# Altium schematic sheet XP2.SchDoc: XP2 Connections
size A; Organization: UCLA High Energy Physics; Address1: L3, 12a Rodborough Rd; Address2: Frenchs Forest; Address3: NSW; Address4: Australia 2086; DocumentNumber: 4; Revision: 2.0; SheetNumber: 4; SheetTotal: 23; CurrentDate: 9/6/2018; ModifiedDate: 9/6/2018; ProjectName: Project
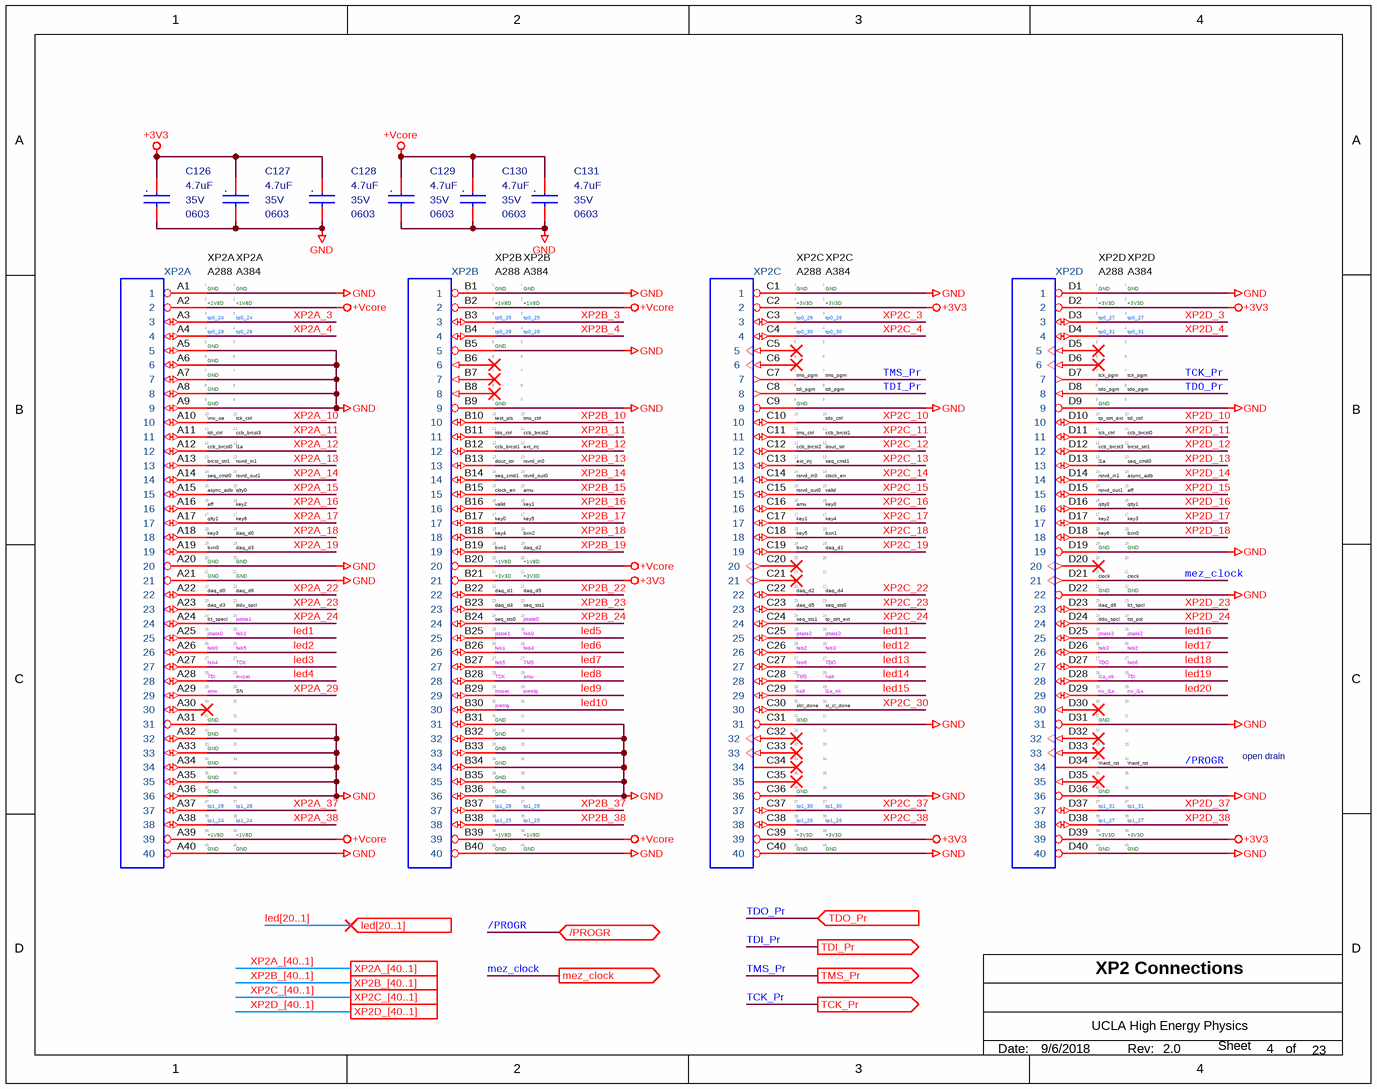
[diagram p0: XP2.SchDoc]

## Parts
(Parts that share a designator on the sheet are numbered #1, #2 ... from top to bottom, then left to right.)
C126  4.7uF  Voltage - Rated: 35V  package: 0603  [MC_S6/SM/C_0603_IPC]
C127  4.7uF  Voltage - Rated: 35V  package: 0603  [MC_S6/SM/C_0603_IPC]
C128  4.7uF  Voltage - Rated: 35V  package: 0603  [MC_S6/SM/C_0603_IPC]
C129  4.7uF  Voltage - Rated: 35V  package: 0603  [MC_S6/SM/C_0603_IPC]
C130  4.7uF  Voltage - Rated: 35V  package: 0603  [MC_S6/SM/C_0603_IPC]
C131  4.7uF  Voltage - Rated: 35V  package: 0603  [MC_S6/SM/C_0603_IPC]
XP2  Samtec_XP2  [MC_S6/TH/SAMTEC_MOLC_40x4]  (value not drawn)  (parts A,B,C,D of 4)
XP?#1  A288_XP2  (value not drawn)  (part A of 4)  (graphical)
XP?#2  A384_XP2  (value not drawn)  (part A of 4)  (graphical)
XP?#3  A288_XP2  (value not drawn)  (part B of 4)  (graphical)
XP?#4  A384_XP2  (value not drawn)  (part B of 4)  (graphical)
XP?#5  A288_XP2  (value not drawn)  (part C of 4)  (graphical)
XP?#6  A384_XP2  (value not drawn)  (part C of 4)  (graphical)
XP?#7  A288_XP2  (value not drawn)  (part D of 4)  (graphical)
XP?#8  A384_XP2  (value not drawn)  (part D of 4)  (graphical)

## Ports
/PROGR (bidir), led[20..1] (in), mez_clock (out), TCK_Pr (out), TDI_Pr (out), TDO_Pr (in), TMS_Pr (out), XP2A_[40..1], XP2B_[40..1], XP2C_[40..1], XP2D_[40..1]

## Nets
+3V3: C126.1 C127.1 C128.1 XP2.B21(21) XP2.C2(2) XP2.C39(39) XP2.D2(2) XP2.D39(39)
+Vcore: C129.1 C130.1 C131.1 XP2.A2(2) XP2.A39(39) XP2.B2(2) XP2.B20(20) XP2.B39(39)
GND: C126.2 C127.2 C128.2 C129.2 C130.2 C131.2 XP2.A1(1) XP2.A5(5) XP2.A6(6) XP2.A7(7) XP2.A8(8) XP2.A9(9) XP2.A20(20) XP2.A21(21) XP2.A31(31) XP2.A32(32) XP2.A33(33) XP2.A34(34) XP2.A35(35) XP2.A36(36) XP2.A40(40) XP2.B1(1) XP2.B5(5) XP2.B9(9) XP2.B31(31) XP2.B32(32) XP2.B33(33) XP2.B34(34) XP2.B35(35) XP2.B36(36) XP2.B40(40) XP2.C1(1) XP2.C9(9) XP2.C31(31) XP2.C36(36) XP2.C40(40) XP2.D1(1) XP2.D9(9) XP2.D19(19) XP2.D22(22) XP2.D31(31) XP2.D36(36) XP2.D40(40)
/PROGR: XP2.D34(34) ; port /PROGR
led1: XP2.A25(25)
led2: XP2.A26(26)
led3: XP2.A27(27)
led4: XP2.A28(28)
led5: XP2.B25(25)
led6: XP2.B26(26)
led7: XP2.B27(27)
led8: XP2.B28(28)
led9: XP2.B29(29)
led10: XP2.B30(30)
led11: XP2.C25(25)
led12: XP2.C26(26)
led13: XP2.C27(27)
led14: XP2.C28(28)
led15: XP2.C29(29)
led16: XP2.D25(25)
led17: XP2.D26(26)
led18: XP2.D27(27)
led19: XP2.D28(28)
led20: XP2.D29(29)
mez_clock: XP2.D21(21) ; port mez_clock
TCK_Pr: XP2.D7(7) ; port TCK_Pr
TDI_Pr: XP2.C8(8) ; port TDI_Pr
TDO_Pr: XP2.D8(8) ; port TDO_Pr
TMS_Pr: XP2.C7(7) ; port TMS_Pr
XP2A_3: XP2.A3(3)
XP2A_4: XP2.A4(4)
XP2A_10: XP2.A10(10)
XP2A_11: XP2.A11(11)
XP2A_12: XP2.A12(12)
XP2A_13: XP2.A13(13)
XP2A_14: XP2.A14(14)
XP2A_15: XP2.A15(15)
XP2A_16: XP2.A16(16)
XP2A_17: XP2.A17(17)
XP2A_18: XP2.A18(18)
XP2A_19: XP2.A19(19)
XP2A_22: XP2.A22(22)
XP2A_23: XP2.A23(23)
XP2A_24: XP2.A24(24)
XP2A_29: XP2.A29(29)
XP2A_37: XP2.A37(37)
XP2A_38: XP2.A38(38)
XP2B_3: XP2.B3(3)
XP2B_4: XP2.B4(4)
XP2B_10: XP2.B10(10)
XP2B_11: XP2.B11(11)
XP2B_12: XP2.B12(12)
XP2B_13: XP2.B13(13)
XP2B_14: XP2.B14(14)
XP2B_15: XP2.B15(15)
XP2B_16: XP2.B16(16)
XP2B_17: XP2.B17(17)
XP2B_18: XP2.B18(18)
XP2B_19: XP2.B19(19)
XP2B_22: XP2.B22(22)
XP2B_23: XP2.B23(23)
XP2B_24: XP2.B24(24)
XP2B_37: XP2.B37(37)
XP2B_38: XP2.B38(38)
XP2C_3: XP2.C3(3)
XP2C_4: XP2.C4(4)
XP2C_10: XP2.C10(10)
XP2C_11: XP2.C11(11)
XP2C_12: XP2.C12(12)
XP2C_13: XP2.C13(13)
XP2C_14: XP2.C14(14)
XP2C_15: XP2.C15(15)
XP2C_16: XP2.C16(16)
XP2C_17: XP2.C17(17)
XP2C_18: XP2.C18(18)
XP2C_19: XP2.C19(19)
XP2C_22: XP2.C22(22)
XP2C_23: XP2.C23(23)
XP2C_24: XP2.C24(24)
XP2C_30: XP2.C30(30)
XP2C_37: XP2.C37(37)
XP2C_38: XP2.C38(38)
XP2D_3: XP2.D3(3)
XP2D_4: XP2.D4(4)
XP2D_10: XP2.D10(10)
XP2D_11: XP2.D11(11)
XP2D_12: XP2.D12(12)
XP2D_13: XP2.D13(13)
XP2D_14: XP2.D14(14)
XP2D_15: XP2.D15(15)
XP2D_16: XP2.D16(16)
XP2D_17: XP2.D17(17)
XP2D_18: XP2.D18(18)
XP2D_23: XP2.D23(23)
XP2D_24: XP2.D24(24)
XP2D_37: XP2.D37(37)
XP2D_38: XP2.D38(38)

Not connected (* = marked no-connect by the designer): XP2 A30(30)* B6(6)* B7(7)* B8(8)* C5(5)* C6(6)* C20(20)* C21(21)* C32(32)* C33(33)* C34(34)* C35(35)* D5(5)* D6(6)* D20(20)* D30(30)* D32(32)* D33(33)* D35(35)*

## Buses and harness runs
bus led[20..1] = port led[20..1]
bus XP2A_[40..1] = port XP2A_[40..1]
bus XP2B_[40..1] = port XP2B_[40..1]
bus XP2C_[40..1] = port XP2C_[40..1]
bus XP2D_[40..1] = port XP2D_[40..1]

## Notes on the sheet
- open drain
- Date:
- Rev:
- of
- Sheet
- (in symbol A288_XP2, part A) XP2A; A288; 1; GND; 2; +1V8D; 3; tp0_24; 4; tp0_28; 5; 6; 7; 8; 9; 10; \mx_oe; 11; tdi_ctrl; 12; ccb_brcst0; 13; brcst_str1; 14; seq_cmd0; 15; async_adb; 16; aff; 17; qlty1; 18; key3; 19; bxn0; 20; 21; 22; daq_d0; 23; daq_d3; 24; lct_specl; 25; jstate0; 26; feb0; 27; feb4; 28; TDI; 29; amu; 30; 31; 32; 33; 34; 35; 36; 37; tp1_28; 38; tp1_24; 39; 40
- (in symbol A288_XP2, part B) XP2B; A288; 1; GND; 2; +1V8D; 3; tp0_25; 4; tp0_29; 5; 6; 7; 8; 9; 10; test_pls; 11; tdo_ctrl; 12; ccb_brcst1; 13; dout_str; 14; seq_cmd1; 15; clock_en; 16; valid; 17; key0; 18; key4; 19; bxn1; 20; 21; +3V3D; 22; daq_d1; 23; daq_d4; 24; seq_sts0; 25; jstate1; 26; feb1; 27; feb5; 28; TCK; 29; invpat; 30; pretrig; 31; 32; 33; 34; 35; 36; 37; tp1_29; 38; tp1_25; 39; 40
- (in symbol A288_XP2, part C) XP2C; A288; 1; GND; 2; +3V3D; 3; tp0_26; 4; tp0_30; 5; 6; 7; tms_pgm; 8; tdi_pgm; 9; 10; 11; tms_ctrl; 12; ccb_brcst2; 13; ext_inj; 14; rsrvd_in0; 15; rsrvd_out0; 16; amu; 17; key1; 18; key5; 19; bxn2; 20; 21; 22; daq_d2; 23; daq_d5; 24; seq_sts1; 25; jstate2; 26; feb2; 27; feb6; 28; TMS; 29; halt; 30; slcl_done; 31; 32; 33; 34; 35; 36; 37; tp1_30; 38; tp1_26; 39; 40
- (in symbol A288_XP2, part D) XP2D; A288; 1; GND; 2; +3V3D; 3; tp0_27; 4; tp0_31; 5; 6; 7; tck_pgm; 8; tdo_pgm; 9; 10; tp_strt_ext; 11; tck_ctrl; 12; ccb_brcst3; 13; l1a; 14; rsrvd_in1; 15; rsrvd_out1; 16; qlty0; 17; key2; 18; key6; 19; 20; 21; clock; 22; 23; daq_d6; 24; ddu_spcl; 25; jstate3; 26; feb3; 27; TDO; 28; l1a_ok; 29; no_l1a; 30; 31; 32; 33; 34; \hard_rst; 35; 36; 37; tp1_31; 38; tp1_27; 39; 40
- (in symbol A384_XP2, part A) XP2A; A384; 1; GND; 2; +1V8D; 3; tp0_24; 4; tp0_28; 5; 6; 7; 8; 9; 10; tck_ctrl; 11; ccb_brcst3; 12; l1a; 13; rsvrd_in1; 14; rsvrd_out1; 15; qlty0; 16; key2; 17; key6; 18; daq_d0; 19; daq_d3; 20; 21; 22; daq_d6; 23; ddu_spcl; 24; jstate1; 25; feb1; 26; feb5; 27; TCK; 28; invpat; 29; SN; 30; 31; 32; 33; 34; 35; 36; 37; tp1_28; 38; tp1_24; 39; 40
- (in symbol A384_XP2, part B) XP2B; A384; 1; GND; 2; +1V8D; 3; tp0_25; 4; tp0_29; 5; 6; 7; 8; 9; 10; tms_ctrl; 11; ccb_brcst2; 12; ext_inj; 13; rsvrd_in0; 14; rsvrd_out0; 15; amu; 16; key1; 17; key5; 18; bxn2; 19; daq_d2; 20; 21; +3V3D; 22; daq_d5; 23; seq_sts1; 24; jstate0; 25; feb0; 26; feb4; 27; TMS; 28; 29; pretrig; 30; 31; 32; 33; 34; 35; 36; 37; tp1_29; 38; tp1_25; 39; 40
- (in symbol A384_XP2, part C) XP2C; A384; 1; GND; 2; +3V3D; 3; tp0_26; 4; tp0_30; 5; 6; 7; tms_pgm; 8; tdi_pgm; 9; 10; tdo_ctrl; 11; ccb_brcst1; 12; dout_str; 13; seq_cmd1; 14; clock_en; 15; valid; 16; key0; 17; key4; 18; bxn1; 19; daq_d1; 20; 21; 22; daq_d4; 23; seq_sts0; 24; tp_strt_ext; 25; jstate3; 26; feb3; 27; TDO; 28; halt; 29; l1a_ok; 30; sl_cl_done; 31; 32; 33; 34; 35; 36; 37; tp1_30; 38; tp1_26; 39; 40
- (in symbol A384_XP2, part D) XP2D; A384; 1; GND; 2; +3V3D; 3; tp0_27; 4; tp0_31; 5; 6; 7; tck_pgm; 8; tdo_pgm; 9; 10; tdi_ctrl; 11; ccb_brcst0; 12; brcst_str1; 13; seq_cmd0; 14; async_adb; 15; aff; 16; qlty1; 17; key3; 18; bxn0; 19; 20; 21; clock; 22; 23; lct_spcl; 24; tst_psl; 25; jstate2; 26; feb2; 27; feb6; 28; TDI; 29; no_l1a; 30; 31; 32; 33; 34; \hard_rst; 35; 36; 37; tp1_31; 38; tp1_27; 39; 40
- (in symbol GRM188R6YA475KE15D) .
- (in symbol Samtec_XP2, part A) XP2A
- (in symbol Samtec_XP2, part B) XP2B
- (in symbol Samtec_XP2, part C) XP2C
- (in symbol Samtec_XP2, part D) XP2D

## Library data of the parts
C126-C131 = GRM188R6YA475KE15D: CAP CER 4.7UF 35V X5R 0603; Manufacturer: Murata; Product Training Modules: High-Cap Multilayer Ceramic Capacitors; Featured Product: GA3 Safety Recognized Capacitors; EDA / CAD Models: Download from Accelerated Designs; Capacitance: 4.7µF; Tolerance: ±10%; Online Catalog: GRM Series; Other Names: 490-7205-2; Supplier 1: Digikey; Manufacturer Part Number: GRM188R6YA475KE15D; Stock 1: 180441; Pricing 1: 1=0.32, 10=0.264, 50=0.1486, 100=0.132, 250=0.099, 500=0.0875, 1000=0.0776 (USD); Standard Package: 4,000; Category: Capacitors; Family: Ceramic Capacitors; Series: GRM; Packaging: Tape & Reel (TR); Temperature Coefficient: X5R; Mounting Type: Surface Mount, MLCC; Operating Temperature: -55°C ~ 85°C; Applications: General Purpose; Package / Case: 0603 (1608 Metric); Size / Dimension: 0.063" L x 0.031" W (1.60mm x 0.80mm); Thickness (Max): 0.031" (0.80mm); ComponentLink1URL: https://datasheet.ciiva.com/46444/1769893-46444984.pdf; ComponentLink1Description: https://datasheet.ciiva.com/46444/1769893-46444984.pdf; ComponentLink2URL: https://datasheet.ciiva.com/46444/1769893-46444985.pdf; ComponentLink2Description: https://datasheet.ciiva.com/46444/1769893-46444985.pdf; ComponentLink3URL: https://datasheet.ciiva.com/14906/partnumbering-e-01-14906426.pdf; ComponentLink3Description: https://datasheet.ciiva.com/14906/partnumbering-e-01-14906426.pdf; ComponentLink4URL: https://datasheet.ciiva.com/14906/partnumbering-e-01-14906427.pdf; ComponentLink4Description: https://datasheet.ciiva.com/14906/partnumbering-e-01-14906427.pdf; ComponentLink5URL: https://datasheet.ciiva.com/14906/partnumbering-e-01-14906428.pdf; ComponentLink5Description: https://datasheet.ciiva.com/14906/partnumbering-e-01-14906428.pdf; Supplier 2: Digikey; Stock 2: 180441; Pricing 2: 1=0.32, 10=0.264, 50=0.1486, 100=0.132, 250=0.099, 500=0.0875, 1000=0.0776 (USD); Supplier Part Number 1: 490-7205-1-ND; Supplier Part Number 2: 490-7205-6-ND
XP2 = Samtec_XP2: Manufacturer Part Number: MOLC-140-01-L-Q-LC; mfgr_foot: 40x4; mfgr: Samtec; mfgr_id: MOLC-140-01-S-Q-LC; COMPROT: 270; COMPGROUP: 0; COMPSIDE: TOP; Contact Termination Type: Through Hole; Gender: Header; No. of Contacts: 160; No. of Rows: 4; Pitch Spacing: 1.27; Product Range: MOLC Series; SVHC: No SVHC (12-Jan-2017; Package: XP2; ComponentLink1Description: http://www.farnell.com/cad/2261282.pdf; ComponentLink1URL: http://www.farnell.com/cad/2261282.pdf; ComponentLink2Description: http://www.farnell.com/datasheets/2261038.pdf; ComponentLink2URL: http://www.farnell.com/datasheets/2261038.pdf; Contact Material: Phosphor Bronze; Contact Plating: Gold Plated Contacts; Manufacturer: SAMTEC; Pricing 1: 1=18.16, 3=17.11, 5=16.18, 10=15.35, 15=14.96, 25=14.34 (GBP); RoHS: YES; Stock 1: 0; Supplier 1: Farnell; Supplier Part Number 1: 2732055
XP?#1 XP?#3 XP?#5 XP?#7 = A288_XP2: mfgr_id: MOLC-140-01-S-Q-LC; mfgr: Samtec; mfgr_foot: 40x4; COMPROT: 180; COMPGROUP: 0; COMPSIDE: TOP; Package: XP2
XP?#2 XP?#4 XP?#6 XP?#8 = A384_XP2: mfgr_id: MOLC-140-01-S-Q-LC; mfgr: Samtec; mfgr_foot: 40x4; COMPROT: 180; COMPGROUP: 0; COMPSIDE: TOP; Package: XP2